# EAGLE design SlotExtenderConverter_Cart (EAGLE 7.5.0)
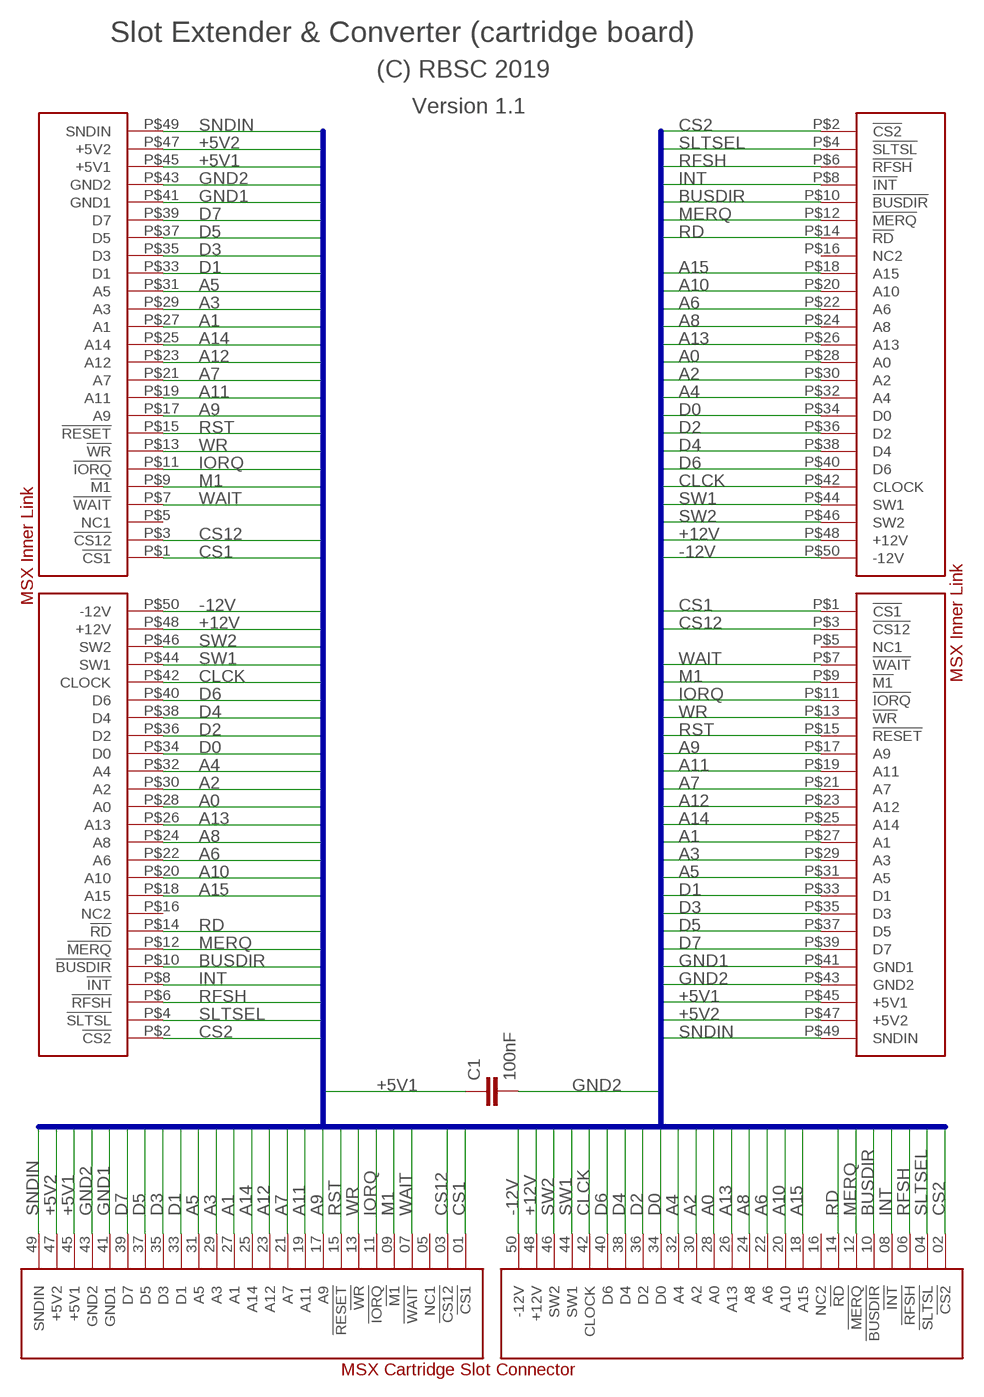
[diagram p0: schematic, sheet 1]

## Parts
C1  100nF  C-EUC0805K  [C0805K]
CN1  MSX_SLOT_CON  [MSX_SLOT_CON]
CN2  MSX_INNER_LINK  [MSX_INNER_LINK]
CN3  MSX_INNER_LINK  [MSX_INNER_LINK]

## Nets
+5V1: C1.1 CN1.45(+5V1) CN2.P$45(+5V1) CN3.P$45(+5V1)
+5V2: CN1.47(+5V2) CN2.P$47(+5V2) CN3.P$47(+5V2)
+12V: CN1.48(+12V) CN2.P$48(+12V) CN3.P$48(+12V)
-12V: CN1.50(-12V) CN2.P$50(-12V) CN3.P$50(-12V)
A0: CN1.28(A0) CN2.P$28(A0) CN3.P$28(A0)
A1: CN1.27(A1) CN2.P$27(A1) CN3.P$27(A1)
A2: CN1.30(A2) CN2.P$30(A2) CN3.P$30(A2)
A3: CN1.29(A3) CN2.P$29(A3) CN3.P$29(A3)
A4: CN1.32(A4) CN2.P$32(A4) CN3.P$32(A4)
A5: CN1.31(A5) CN2.P$31(A5) CN3.P$31(A5)
A6: CN1.22(A6) CN2.P$22(A6) CN3.P$22(A6)
A7: CN1.21(A7) CN2.P$21(A7) CN3.P$21(A7)
A8: CN1.24(A8) CN2.P$24(A8) CN3.P$24(A8)
A9: CN1.17(A9) CN2.P$17(A9) CN3.P$17(A9)
A10: CN1.20(A10) CN2.P$20(A10) CN3.P$20(A10)
A11: CN1.19(A11) CN2.P$19(A11) CN3.P$19(A11)
A12: CN1.23(A12) CN2.P$23(A12) CN3.P$23(A12)
A13: CN1.26(A13) CN2.P$26(A13) CN3.P$26(A13)
A14: CN1.25(A14) CN2.P$25(A14) CN3.P$25(A14)
A15: CN1.18(A15) CN2.P$18(A15) CN3.P$18(A15)
BUSDIR: CN1.10(!BUSDIR) CN2.P$10(!BUSDIR) CN3.P$10(!BUSDIR)
CLCK: CN1.42(CLOCK) CN2.P$42(CLOCK) CN3.P$42(CLOCK)
CS1: CN1.01(!CS1) CN2.P$1(!CS1) CN3.P$1(!CS1)
CS2: CN1.02(!CS2) CN2.P$2(!CS2) CN3.P$2(!CS2)
CS12: CN1.03(!CS12) CN2.P$3(!CS12) CN3.P$3(!CS12)
D0: CN1.34(D0) CN2.P$34(D0) CN3.P$34(D0)
D1: CN1.33(D1) CN2.P$33(D1) CN3.P$33(D1)
D2: CN1.36(D2) CN2.P$36(D2) CN3.P$36(D2)
D3: CN1.35(D3) CN2.P$35(D3) CN3.P$35(D3)
D4: CN1.38(D4) CN2.P$38(D4) CN3.P$38(D4)
D5: CN1.37(D5) CN2.P$37(D5) CN3.P$37(D5)
D6: CN1.40(D6) CN2.P$40(D6) CN3.P$40(D6)
D7: CN1.39(D7) CN2.P$39(D7) CN3.P$39(D7)
GND1: CN1.41(GND1) CN2.P$41(GND1) CN3.P$41(GND1)
GND2: C1.2 CN1.43(GND2) CN2.P$43(GND2) CN3.P$43(GND2)
INT: CN1.08(!INT) CN2.P$8(!INT) CN3.P$8(!INT)
IORQ: CN1.11(!IORQ) CN2.P$11(!IORQ) CN3.P$11(!IORQ)
M1: CN1.09(!M1) CN2.P$9(!M1) CN3.P$9(!M1)
MERQ: CN1.12(!MERQ) CN2.P$12(!MERQ) CN3.P$12(!MERQ)
RD: CN1.14(!RD) CN2.P$14(!RD) CN3.P$14(!RD)
RFSH: CN1.06(!RFSH) CN2.P$6(!RFSH) CN3.P$6(!RFSH)
RST: CN1.15(!RESET) CN2.P$15(!RESET) CN3.P$15(!RESET)
SLTSEL: CN1.04(!SLTSL) CN2.P$4(!SLTSL) CN3.P$4(!SLTSL)
SNDIN: CN1.49(SNDIN) CN2.P$49(SNDIN) CN3.P$49(SNDIN)
SW1: CN1.44(SW1) CN2.P$44(SW1) CN3.P$44(SW1)
SW2: CN1.46(SW2) CN2.P$46(SW2) CN3.P$46(SW2)
WAIT: CN1.07(!WAIT) CN2.P$7(!WAIT) CN3.P$7(!WAIT)
WR: CN1.13(!WR) CN2.P$13(!WR) CN3.P$13(!WR)
Unconnected: CN1.05(NC1) CN1.16(NC2) CN2.P$5(NC1) CN2.P$16(NC2) CN3.P$5(NC1) CN3.P$16(NC2)

## Buses
A0,A1,A2,A3,A4,A5,A6,A7,A8,A9,A10,A11,A12,A13,A14,A15,D0,D1,D2,D3,D4,D5,D6,D7,SLTSEL,CS1,CS2,CS12,RD,SNDIN,RFSH,MERQ,BUSDIR,-12V,+12V,GND1,GND2,+5V1,+5V2,WAIT,RST,M1,IORQ,WR,CLCK,INT,SW1,SW2

## Notes on the sheet
- Slot Extender & Converter (cartridge board)
- (C) RBSC 2019
- Version 1.1

## Library data of the parts
C1 = rcl:C-EU: CAPACITOR, European symbol
CN1 = msx_edge_conn:MSX_SLOT_CON
CN2 CN3 = msx_inner_link:MSX_INNER_LINK

## Board
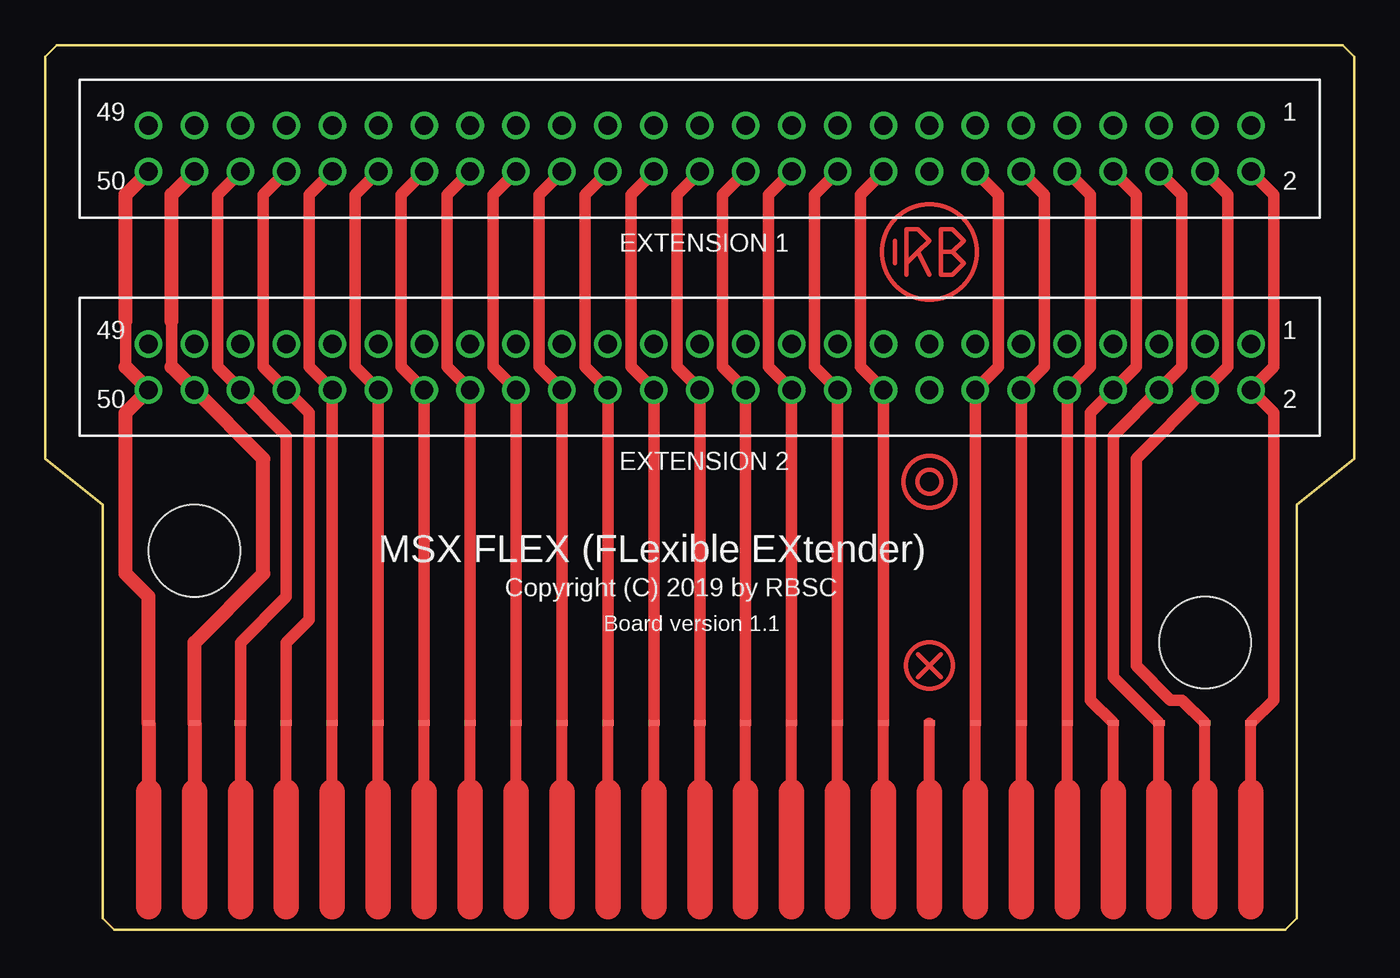
[diagram p1: board, top side]
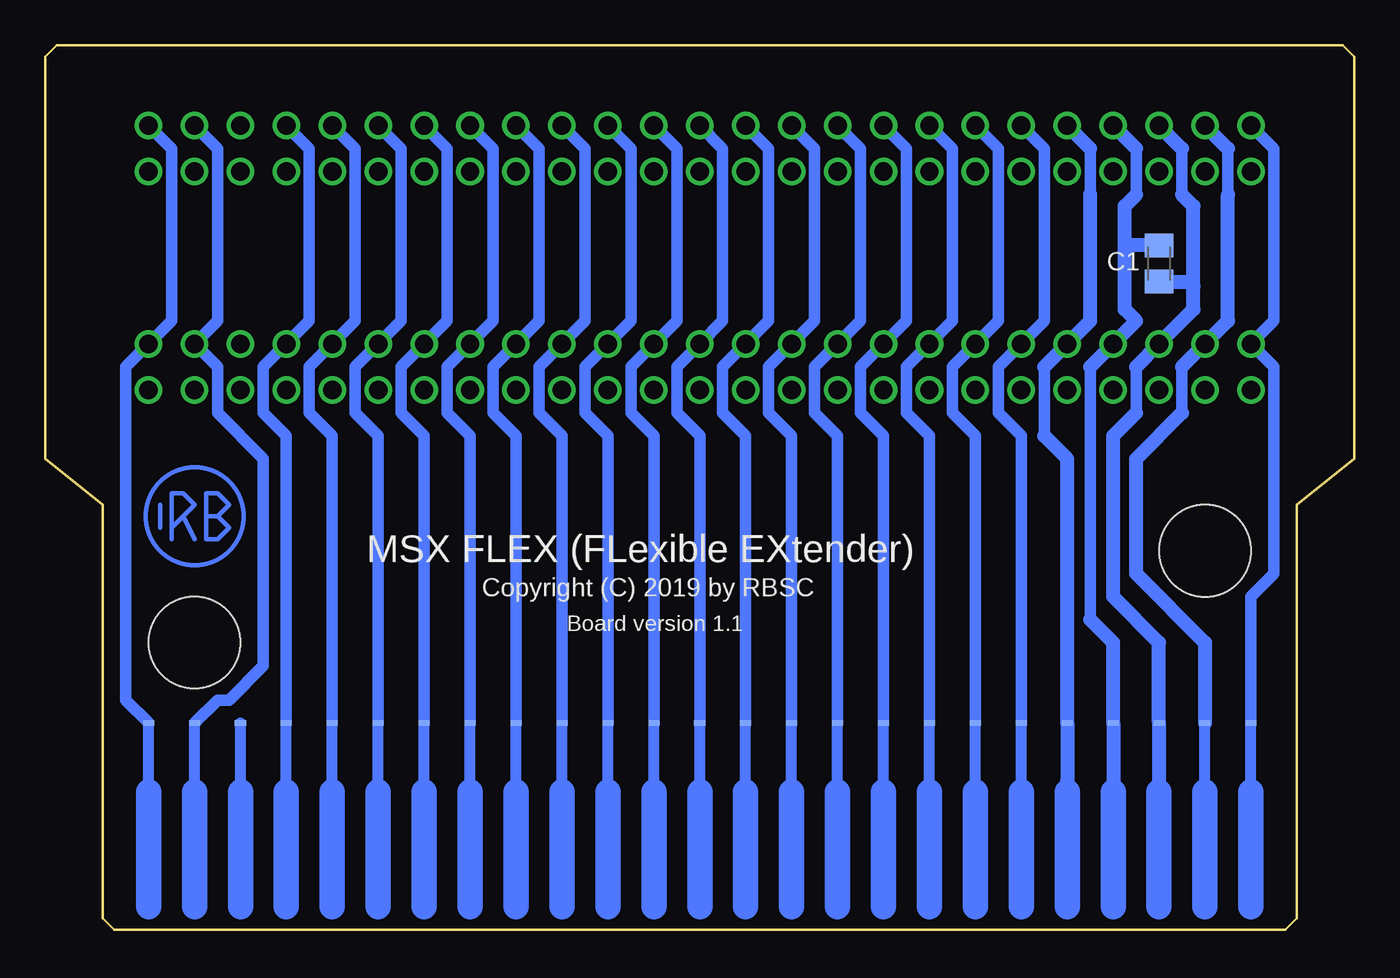
[diagram p2: board, bottom side, seen from below]

Size 72.39 x 48.9 mm. Coordinates in mm from the lower left corner, seen from the top.
Outline: 3.17,10.16 3.17,23.5 0,26.04 0,48.26 0.63,48.9 71.75,48.9 72.39,48.26 72.39,26.04 69.22,23.5 69.22,10.16
Copper layers (1*16): Top 0.035mm / dielectric 1.5mm / Bottom 0.035mm
Design rules "default *": minimum track width 10mil, minimum drill 24mil, track to track 8mil, track to pad 8mil, pad to pad 8mil, via to via 8mil, smd to smd 8mil, copper to edge 40mil, drill to drill 8mil, minimum pad ring 10mil, minimum via ring 8mil, stop-mask expansion 4mil, vias tented up to drill 24mil, thermal gap 10mil
Holes 5.08 mm at 8.25,20.95 64.14,15.88

### Footprints (pad centres in the part's own frame; a part is rotated, then mirrored left to right if it is on the bottom)
C0805K = smd 1.3 x 1.6: 1 -1,0; 2 1,0
MSX_SLOT_CON = smd 0.61 x 0.305 bottom: 01 30.48,11.43; 03 27.94,11.43; 05 25.4,11.43; 07 22.86,11.43; 09 20.32,11.43; 11 17.78,11.43; 13 15.24,11.43; 15 12.7,11.43; 17 10.16,11.43; 19 7.62,11.43; 21 5.08,11.43; 23 2.54,11.43; 25 0,11.43; 27 -2.54,11.43; 29 -5.08,11.43; 31 -7.62,11.43; 33 -10.16,11.43; 35 -12.7,11.43; 37 -15.24,11.43; 39 -17.78,11.43; 41 -20.32,11.43; 43 -22.86,11.43; 45 -25.4,11.43; 47 -27.94,11.43; 49 -30.48,11.43 | smd 0.61 x 0.305: 02 30.48,11.43; 04 27.94,11.43; 06 25.4,11.43; 08 22.86,11.43; 10 20.32,11.43; 12 17.78,11.43; 14 15.24,11.43; 16 12.7,11.43; 18 10.16,11.43; 20 7.62,11.43; 22 5.08,11.43; 24 2.54,11.43; 26 0,11.43; 28 -2.54,11.43; 30 -5.08,11.43; 32 -7.62,11.43; 34 -10.16,11.43; 36 -12.7,11.43; 38 -15.24,11.43; 40 -17.78,11.43; 42 -20.32,11.43; 44 -22.86,11.43; 46 -25.4,11.43; 48 -27.94,11.43; 50 -30.48,11.43
MSX_INNER_LINK = drill 1.016: P$1 63.5,5.08; P$2 63.5,2.54; P$3 60.96,5.08; P$4 60.96,2.54; P$5 58.42,5.08; P$6 58.42,2.54; P$7 55.88,5.08; P$8 55.88,2.54; P$9 53.34,5.08; P$10 53.34,2.54; P$11 50.8,5.08; P$12 50.8,2.54; P$13 48.26,5.08; P$14 48.26,2.54; P$15 45.72,5.08; P$16 45.72,2.54; P$17 43.18,5.08; P$18 43.18,2.54; P$19 40.64,5.08; P$20 40.64,2.54; P$21 38.1,5.08; P$22 38.1,2.54; P$23 35.56,5.08; P$24 35.56,2.54; P$25 33.02,5.08; P$26 33.02,2.54; P$27 30.48,5.08; P$28 30.48,2.54; P$29 27.94,5.08; P$30 27.94,2.54; P$31 25.4,5.08; P$32 25.4,2.54; P$33 22.86,5.08; P$34 22.86,2.54; P$35 20.32,5.08; P$36 20.32,2.54; P$37 17.78,5.08; P$38 17.78,2.54; P$39 15.24,5.08; P$40 15.24,2.54; P$41 12.7,5.08; P$42 12.7,2.54; P$43 10.16,5.08; P$44 10.16,2.54; P$45 7.62,5.08; P$46 7.62,2.54; P$47 5.08,5.08; P$48 5.08,2.54; P$49 2.54,5.08; P$50 2.54,2.54

### Placement (x,y rotation side)
C1  10.79,36.83 90 bottom
CN1  36.2,0 0 top
CN2  3.17,39.37 0 top
CN3  3.17,27.3 0 top

### Tracks (layer width: path | path; a pad name or v marks a point on that pad's centre or on a via)
+5V1
  Bottom 0.635: 12.07,28.57 12.07,31.11 | 9.52,40.64 9.52,43.18
  Bottom 0.762: 12.07,28.57 13.34,27.3 13.34,18.41 10.79,15.88 CN1.45 10.79,7.62 | 12.07,31.11 CN3.P$45 8.89,34.29 8.89,35.56 | 9.52,43.18 CN2.P$45 | 8.89,35.56 8.89,40.01 9.52,40.64 | C1.1 9.16,35.83 8.89,35.56
+5V2
  Bottom 0.635: 9.52,28.57 9.52,31.11 | 6.98,40.64 6.98,43.18
  Bottom 0.762: 9.52,28.57 12.07,26.04 12.07,19.68 8.25,15.88 CN1.47 | 9.52,31.11 CN3.P$47 6.98,33.66 6.98,40.64 | 6.98,43.18 CN2.P$47
+12V
  Top 0.635: 6.98,31.11 6.98,33.66
  Top 0.762: 8.25,7.62 CN1.48 8.25,15.88 12.07,19.68 12.07,26.04 CN3.P$48 6.98,31.11 | CN2.P$48 6.98,40.64 6.98,33.66
-12V
  Top 0.635: 4.45,31.11 4.45,33.66
  Top 0.762: 4.45,31.11 CN3.P$50 4.45,28.57 4.45,19.68 5.71,18.41 CN1.50 5.71,7.62 | CN2.P$50 4.45,40.64 4.45,33.66
A0
  Top 0.635: CN1.28 CN3.P$28 32.38,31.11 32.38,40.64 CN2.P$28
A1
  Bottom 0.635: CN1.27 33.66,27.3 34.92,28.57 34.92,31.11 CN3.P$27 32.38,33.66 32.38,43.18 CN2.P$27
A2
  Top 0.635: CN1.30 CN3.P$30 29.85,31.11 29.85,40.64 CN2.P$30
A3
  Bottom 0.635: CN1.29 31.12,27.3 32.38,28.57 32.38,31.11 CN3.P$29 29.85,33.66 29.85,43.18 CN2.P$29
A4
  Top 0.635: CN1.32 CN3.P$32 27.3,31.11 27.3,40.64 CN2.P$32
A5
  Bottom 0.635: CN1.31 28.57,27.3 29.85,28.57 29.85,31.11 CN3.P$31 27.3,33.66 27.3,43.18 CN2.P$31
A6
  Top 0.635: CN1.22 CN3.P$22 40,31.11 40,40.64 CN2.P$22
A7
  Bottom 0.635: CN1.21 41.27,27.3 42.54,28.57 42.54,31.11 CN3.P$21 40,33.66 40,43.18 CN2.P$21
A8
  Top 0.635: CN1.24 CN3.P$24 37.46,31.11 37.46,40.64 CN2.P$24
A9
  Bottom 0.635: CN1.17 46.35,27.3 47.62,28.57 47.62,31.11 CN3.P$17 45.08,33.66 45.08,43.18 CN2.P$17
A10
  Top 0.635: CN1.20 CN3.P$20 42.54,31.11 42.54,40.64 CN2.P$20
A11
  Bottom 0.635: CN1.19 43.81,27.3 45.08,28.57 45.08,31.11 CN3.P$19 42.54,33.66 42.54,43.18 CN2.P$19
A12
  Bottom 0.635: CN1.23 38.73,27.3 40,28.57 40,31.11 CN3.P$23 37.46,33.66 37.46,43.18 CN2.P$23
A13
  Top 0.635: CN1.26 CN3.P$26 34.92,31.11 34.92,40.64 CN2.P$26
A14
  Bottom 0.635: CN1.25 36.2,27.3 37.46,28.57 37.46,31.11 CN3.P$25 34.92,33.66 34.92,43.18 CN2.P$25
A15
  Top 0.635: CN1.18 CN3.P$18 45.08,31.11 45.08,40.64 CN2.P$18
BUSDIR
  Top 0.635: CN1.10 CN3.P$10 57.78,31.11 57.78,40.64 CN2.P$10
CLCK
  Top 0.635: CN1.42 CN3.P$42 14.61,31.11 14.61,40.64 CN2.P$42
CS1
  Bottom 0.635: CN1.01 67.94,12.7 67.94,31.11 CN3.P$1 65.41,33.66 65.41,43.18 CN2.P$1
CS2
  Top 0.635: CN1.02 67.94,12.7 67.94,28.57 CN3.P$2 67.94,31.11 67.94,40.64 CN2.P$2
CS12
  Bottom 0.635: CN1.03 62.86,12.7 62.23,12.7 60.32,14.61 60.32,26.04 62.86,28.57 62.86,31.11 CN3.P$3 62.86,33.66 62.86,43.18 CN2.P$3
D0
  Top 0.635: CN1.34 CN3.P$34 24.77,31.11 24.77,40.64 CN2.P$34
D1
  Bottom 0.635: CN1.33 26.04,27.3 27.3,28.57 27.3,31.11 CN3.P$33 24.77,33.66 24.77,43.18 CN2.P$33
D2
  Top 0.635: CN1.36 CN3.P$36 22.23,31.11 22.23,40.64 CN2.P$36
D3
  Bottom 0.635: CN1.35 23.5,27.3 24.77,28.57 24.77,31.11 CN3.P$35 22.23,33.66 22.23,43.18 CN2.P$35
D4
  Top 0.635: CN1.38 CN3.P$38 19.69,31.11 19.69,40.64 CN2.P$38
D5
  Bottom 0.635: CN1.37 20.96,27.3 22.23,28.57 22.23,31.11 CN3.P$37 19.69,33.66 19.69,43.18 CN2.P$37
D6
  Top 0.635: CN1.40 CN3.P$40 17.14,31.11 17.14,40.64 CN2.P$40
D7
  Bottom 0.635: CN1.39 18.41,27.3 19.69,28.57 19.69,31.11 CN3.P$39 17.14,33.66 17.14,43.18 CN2.P$39
GND1
  Bottom 0.635: 17.14,27.3 17.14,31.11 | 14.61,40.64 14.61,43.18
  Bottom 0.762: 17.14,27.3 15.88,26.04 CN1.41 15.88,8.26 | 17.14,31.11 CN3.P$41 14.61,33.66 14.61,40.64 | 14.61,43.18 CN2.P$41
GND2
  Bottom 0.635: 14.61,17.14 14.61,31.11 | 12.07,40.64 12.07,43.18
  Bottom 0.762: 14.61,17.14 13.34,15.88 CN1.43 13.34,7.62 | 14.61,31.11 CN3.P$43 12.07,33.66 12.7,34.29 12.7,38.1 | 12.07,43.18 CN2.P$43 | 12.7,38.1 12.7,40.01 12.07,40.64 | C1.2 12.43,37.83 12.7,38.1
INT
  Top 0.635: CN1.08 57.78,12.7 57.78,28.57 CN3.P$8 60.32,31.11 60.32,40.64 CN2.P$8
IORQ
  Bottom 0.635: CN1.11 53.97,27.3 55.24,28.57 55.24,31.11 CN3.P$11 52.7,33.66 52.7,43.18 CN2.P$11
M1
  Bottom 0.635: CN1.09 56.52,27.3 57.78,28.57 57.78,31.11 CN3.P$9 55.24,33.66 55.24,43.18 CN2.P$9
MERQ
  Top 0.635: CN1.12 CN3.P$12 55.24,31.11 55.24,40.64 CN2.P$12
N$1
  Top 1.422: 13.34,2.54 13.34,1.27
N$2
  Top 0.254: 48.26,15.24 49.53,13.97
N$3
  Top 0.254: 49.53,15.24 48.26,13.97
N$4
  Top 0.254: 47.62,36.83 47.62,38.73 48.26,38.73 48.89,38.1 48.26,37.47 | 47.62,36.83 47.62,36.2 | 48.26,37.47 47.62,36.83 | 48.89,36.2 48.26,37.47
N$5
  Top 0.254: 49.53,37.47 49.53,36.2 50.16,36.2 50.8,36.83 50.16,37.47 | 49.53,37.47 49.53,38.73 50.16,38.73 50.8,38.1 50.16,37.47 | 50.16,37.47 49.53,37.47
N$6
  Top 0.254: 46.99,38.1 46.99,36.83
N$7
  Bottom 0.254: 66.04,23.5 66.04,22.23
N$8
  Bottom 0.254: 65.41,21.59 65.41,22.23 | 65.41,22.23 65.41,24.13 64.77,24.13 64.14,23.5 64.77,22.86 | 64.77,22.86 65.41,22.23 | 64.77,22.86 64.14,21.59
N$9
  Bottom 0.254: 63.5,22.86 63.5,21.59 62.86,21.59 62.23,22.23 62.86,22.86 | 62.86,22.86 62.23,23.5 62.86,24.13 63.5,24.13 63.5,22.86 | 63.5,22.86 62.86,22.86
RD
  Top 0.635: CN1.14 CN3.P$14 52.7,31.11 52.7,40.64 CN2.P$14
RFSH
  Top 0.635: CN1.06 59.05,13.97 59.05,27.3 CN3.P$6 62.86,31.11 62.86,40.64 CN2.P$6
RST
  Bottom 0.635: CN1.15 48.89,27.3 50.16,28.57 50.16,31.11 CN3.P$15 47.62,33.66 47.62,43.18 CN2.P$15
SLTSEL
  Top 0.635: CN1.04 62.86,12.7 62.23,12.7 60.32,14.61 60.32,26.04 CN3.P$4 65.41,31.11 65.41,40.64 CN2.P$4
SNDIN
  Bottom 0.635: CN1.49 5.71,18.41 4.45,19.68 4.45,31.11 CN3.P$49 4.45,33.66 4.45,43.18 CN2.P$49
SW1
  Top 0.635: CN1.44 13.34,15.88 14.61,17.14 14.61,28.57 CN3.P$44 12.07,31.11 12.07,40.64 CN2.P$44
SW2
  Top 0.635: CN1.46 10.79,15.88 13.34,18.41 13.34,27.3 CN3.P$46 9.52,31.11 9.52,40.64 CN2.P$46
WAIT
  Bottom 0.635: CN1.07 59.05,27.3 60.32,28.57 60.32,31.11 CN3.P$7 57.78,33.66 57.78,43.18 CN2.P$7
WR
  Bottom 0.635: CN1.13 51.43,27.3 52.7,28.57 52.7,31.11 CN3.P$13 50.16,33.66 50.16,43.18 CN2.P$13
(copper drawn outside any net)
  shapes: Bottom circle x1, Top circle x4

### Text on the board
tNames: EXTENSION 1 | EXTENSION 2 | MSX FLEX (FLexible EXtender) | Copyright (C) 2019 by RBSC | Board version 1.1
bNames: MSX FLEX (FLexible EXtender) | Copyright (C) 2019 by RBSC | Board version 1.1